# EAGLE design untitled (EAGLE 9.6.2)
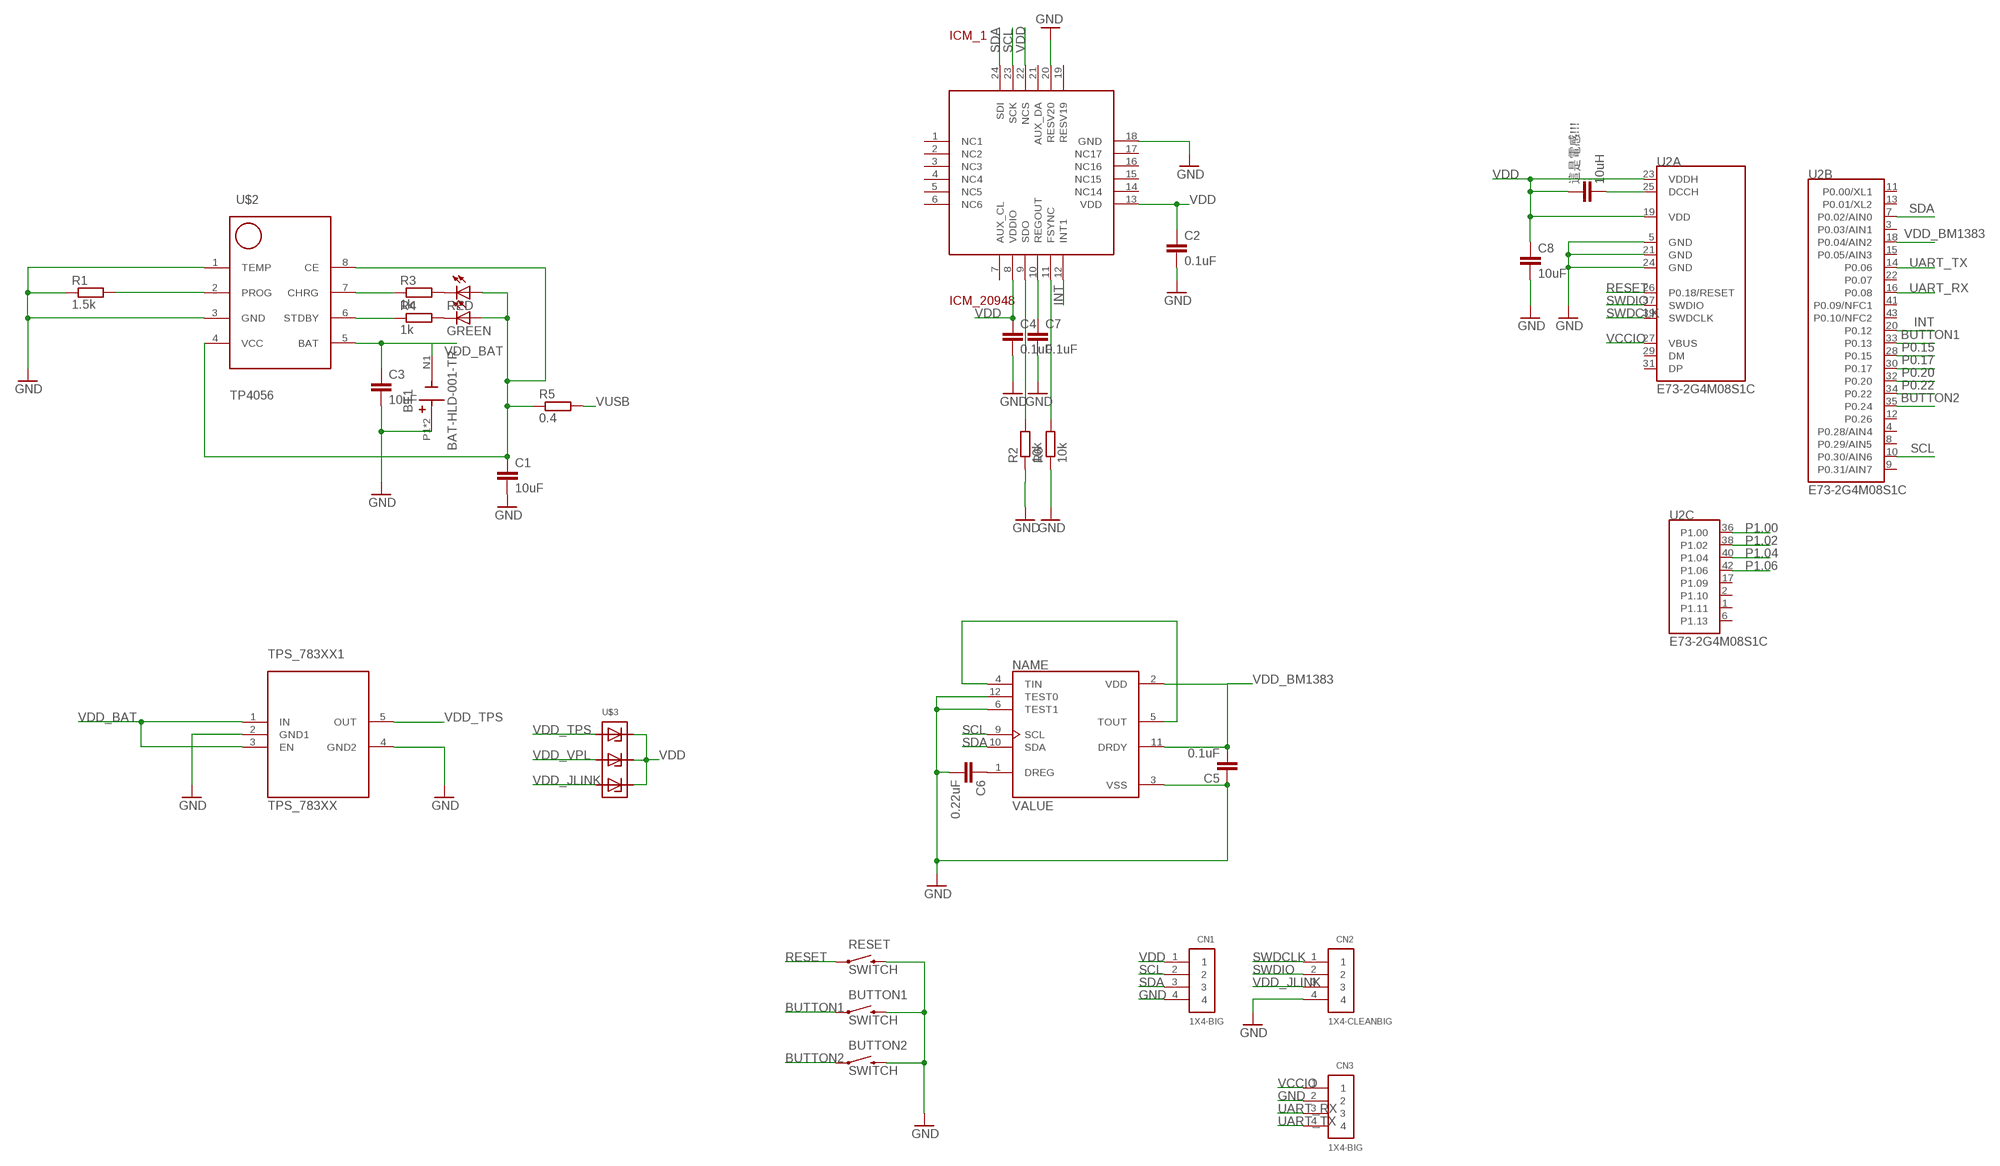
[diagram p0: schematic, sheet 1]

## Parts
BT1  BAT-HLD-001-TR  [BAT_BAT-HLD-001-TR]
BUTTON1  SWITCH  [SWITCH_2PIN]
BUTTON2  SWITCH  [SWITCH_2PIN]
C1  10uF  C-EUC0805  [C0805]
C2  0.1uF  C-EUC0805  [C0805]
C3  10uF  C-EUC0805  [C0805]
C4  0.1uF  C-EUC0805  [C0805]
C5  0.1uF  C-EUC0805  [C0805]
C6  0.22uF  C-EUC0805  [C0805]
C7  0.1uF  C-EUC0805  [C0805]
C8  10uF  C-EUC0805  [C0805]
CN1  1X4-BIG  [1X04-BIG]
CN2  1X4-CLEANBIG  [1X04-CLEANBIG]
CN3  1X4-BIG  [1X04-BIG]
GREEN  LED_E  [LED_1206]
ICM_1  ICM_20948  [QFN40P300X300X105-25N]
R1  1.5k  R  [R0805]
R2  10k  R  [R0805]
R3  1k  R  [R0805]
R4  1k  R  [R0805]
R5  0.4  R  [R0805]
R6  10k  R  [R0805]
RED  LED_E  [LED_1206]
RESET  SWITCH  [SWITCH_2PIN]
TPS_783XX1  TPS_783XX  [SOT65P280X145-5N]
U1  BM1383AGLV-ZE2  [PQFN55P250X250X100-12N]
U2  E73-2G4M08S1C  [E73-2G4M08S1C]
U$2  TP4056  [SOP8]
U$3  SD103ATW  [SOT363]
這是電感!!!  10uH  C-EUC0805  [C0805]

## Nets
BUTTON1: BUTTON1.1 U2.33(B:P0.13)
BUTTON2: BUTTON2.1 U2.35(B:P0.24)
GND: BT1.P1(+) BT1.P2(+) BUTTON1.2 BUTTON2.2 C1.2 C2.2 C3.2 C4.2 C5.1 C6.2 C7.2 C8.2 CN1.4 CN2.4 CN3.2 ICM_1.18(GND) ICM_1.20(RESV20) R1.1 R2.1 R6.1 RESET.2 TPS_783XX1.2(GND1) TPS_783XX1.4(GND2) U1.3(VSS) U1.6(TEST1) U1.12(TEST0) U2.5(A:GND) U2.21(A:GND) U2.24(A:GND) U$2.1(TEMP) U$2.3(GND)
INT: ICM_1.12(INT1) U2.20(B:P0.12)
N$1: R1.2 U$2.2(PROG)
N$2: GREEN.C R4.2
N$3: R3.1 U$2.7(CHRG)
N$4: R3.2 RED.C
N$5: R4.1 U$2.6(STDBY)
N$6: C1.1 GREEN.A R5.1 RED.A U$2.4(VCC) U$2.8(CE)
N$8: U1.4(TIN) U1.5(TOUT)
N$9: C6.1 U1.1(DREG)
N$10: U2.25(A:DCCH) 這是電感!!!.2
N$11: ICM_1.9(SDO) R2.2
N$13: C7.1 ICM_1.10(REGOUT)
N$15: ICM_1.11(FSYNC) R6.2
P0.15: U2.28(B:P0.15)
P0.17: U2.30(B:P0.17)
P0.20: U2.32(B:P0.20)
P0.22: U2.34(B:P0.22)
P1.00: U2.36(C:P1.00)
P1.02: U2.38(C:P1.02)
P1.04: U2.40(C:P1.04)
P1.06: U2.42(C:P1.06)
RESET: RESET.1 U2.26(A:P0.18/RESET)
SCL: CN1.2 ICM_1.23(SCK) U1.9(SCL) U2.10(B:P0.30/AIN6)
SDA: CN1.3 ICM_1.24(SDI) U1.10(SDA) U2.7(B:P0.02/AIN0)
SWDCLK: CN2.1 U2.39(A:SWDCLK)
SWDIO: CN2.2 U2.37(A:SWDIO)
UART_RX: CN3.3 U2.16(B:P0.08)
UART_TX: CN3.4 U2.14(B:P0.06)
VCCIO: CN3.1 U2.27(A:VBUS)
VDD: C2.1 C4.1 C8.1 CN1.1 ICM_1.8(VDDIO) ICM_1.13(VDD) ICM_1.22(NCS) U2.19(A:VDD) U2.23(A:VDDH) U$3.2 U$3.4 U$3.6 這是電感!!!.1
VDD_BAT: BT1.N1(-) C3.1 TPS_783XX1.1(IN) TPS_783XX1.3(EN) U$2.5(BAT)
VDD_BM1383: C5.2 U1.2(VDD) U1.11(DRDY) U2.18(B:P0.04/AIN2)
VDD_JLINK: CN2.3 U$3.5
VDD_TPS: TPS_783XX1.5(OUT) U$3.1
VDD_VPL: U$3.3
VUSB: R5.2
Unconnected: ICM_1.1(NC1) ICM_1.2(NC2) ICM_1.3(NC3) ICM_1.4(NC4) ICM_1.5(NC5) ICM_1.6(NC6) ICM_1.7(AUX_CL) ICM_1.14(NC14) ICM_1.15(NC15) ICM_1.16(NC16) ICM_1.17(NC17) ICM_1.19(RESV19) ICM_1.21(AUX_DA) U2.1(C:P1.11) U2.2(C:P1.10) U2.3(B:P0.03/AIN1) U2.4(B:P0.28/AIN4) U2.6(C:P1.13) U2.8(B:P0.29/AIN5) U2.9(B:P0.31/AIN7) U2.11(B:P0.00/XL1) U2.12(B:P0.26) U2.13(B:P0.01/XL2) U2.15(B:P0.05/AIN3) U2.17(C:P1.09) U2.22(B:P0.07) U2.29(A:DM) U2.31(A:DP) U2.41(B:P0.09/NFC1) U2.43(B:P0.10/NFC2)

## Library data of the parts
BT1 = BAT-HLD-001-TR:BAT-HLD-001-TR: Battery Retainer Coin, 20.0mm 1 Cell SMD (SMT) Tab Check availability <https://pricing.snapeda.com/parts/BAT-HLD-001-TR/Linx/view-part?ref=eda>; AVAILABILITY: In Stock; DESCRIPTION: Battery Retainer Coin, 20.0mm 1 Cell SMD (SMT) Tab; MF: Linx; MP: BAT-HLD-001-TR; PACKAGE: None; PRICE: None; PURCHASE-URL: https://pricing.snapeda.com/search/part/BAT-HLD-001-TR/?ref=eda
BUTTON1 BUTTON2 RESET = all_in_one:SWITCH
C1-C8 這是電感!!! = rcl-2:C-EU: CAPACITOR, European symbol
CN1-CN3 = adafruit:1X4: 4-pin connector
GREEN RED = eagle-ltspice:LED_E: LED Source: http://www.osram.convergy.de Source: www.luxeon.com Source: www.kingbright.com; SPICEMODEL: NONE; SPICEPREFIX: D; SPICETYPE: diode
ICM_1 = all_in_one:ICM_20948
R1-R6 = eagle-ltspice:R: RESISTOR, European symbol; SPICEMODEL: NONE; SPICEPREFIX: R
TPS_783XX1 = all_in_one:TPS_783XX
U1 = BM1383AGLV-ZE2:BM1383AGLV-ZE2: Pressure Sensor 30kPa to 110kPa 12-Pin CLGA T/R Check availability <https://pricing.snapeda.com/parts/BM1383AGLV-ZE2/Rohm/view-part?ref=eda>; AVAILABILITY: In Stock; DESCRIPTION: Pressure Sensor 4.35PSI ~ 15.95PSI (30kPa ~ 110kPa) Absolute - 16 b 12-VFLGA; MF: Rohm; MP: BM1383AGLV-ZE2; PACKAGE: VFLGA-12 Rohm; PRICE: None; PURCHASE-URL: https://pricing.snapeda.com/search/part/BM1383AGLV-ZE2/?ref=eda
U2 = E73-2G4M08S1C:E73-2G4M08S1C
U$2 = all_in_one:TP4056
U$3 = all_in_one:SD103ATW

## Board
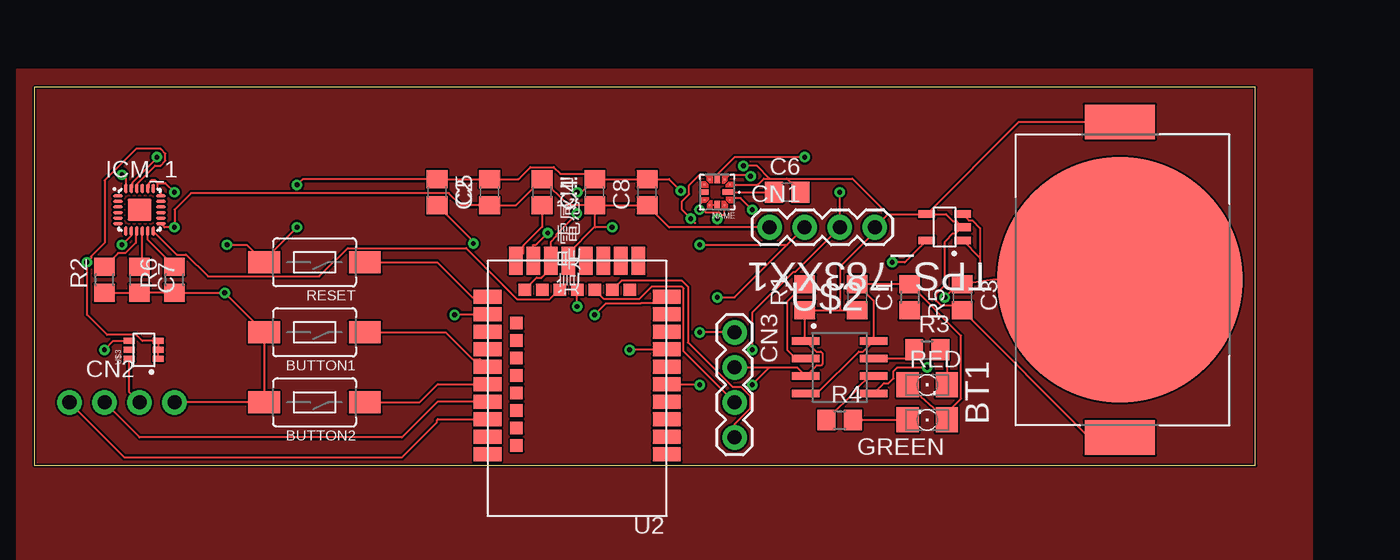
[diagram p1: board, top side]
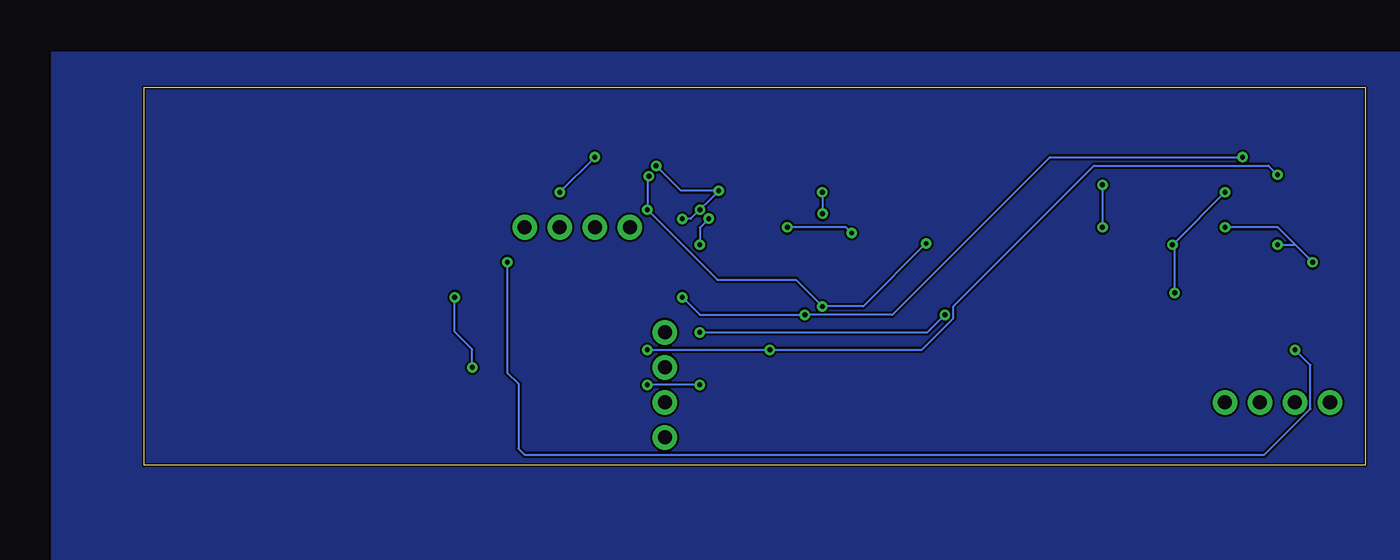
[diagram p2: board, bottom side, seen from below]

Size 88.57 x 27.42 mm. Coordinates in mm from the lower left corner, seen from the top.
Outline: 0,0 88.57,0 88.57,27.42 0,27.42 0,0
Copper layers (1*16): Top 0.035mm / dielectric 1.5mm / Bottom 0.035mm
Design rules "default1": minimum track width 6mil, minimum drill 0.3mm, track to track 6mil, track to pad 6mil, pad to pad 6mil, via to via 6mil, smd to smd 6mil, copper to edge 6mil, drill to drill 6mil, minimum pad ring 10mil, minimum via ring 8mil, stop-mask expansion 4mil, vias tented up to drill 0mil, thermal gap 6mil

### Footprints (pad centres in the part's own frame; a part is rotated, then mirrored left to right if it is on the bottom)
BAT_BAT-HLD-001-TR = smd 17.8 x 17.8: N1 0,0 | smd 2.5 x 5.1: P1 -11.45,0; P2 11.45,0
SWITCH_2PIN = smd 2.3 x 1.6: 1 -3.65,0; 2 3.65,0
C0805 = smd 1.3 x 1.5: 1 -0.95,0; 2 0.95,0
1X04-BIG = drill 1.016 pad 1.778: 1 0,0; 2 2.54,0; 3 5.08,0; 4 7.62,0
1X04-CLEANBIG = drill 1.016 pad 1.778: 1 -3.81,0; 2 -1.27,0; 3 1.27,0; 4 3.81,0
LED_1206 = smd 1.6 x 1.803: A -1.422,0; C 1.422,0
QFN40P300X300X105-25N = smd 0.7 x 0.2: 1 -1.55,1; 2 -1.55,0.6; 3 -1.55,0.2; 4 -1.55,-0.2; 5 -1.55,-0.6; 6 -1.55,-1; 13 1.55,-1; 14 1.55,-0.6; 15 1.55,-0.2; 16 1.55,0.2; 17 1.55,0.6; 18 1.55,1 | smd 0.2 x 0.7: 7 -1,-1.55; 8 -0.6,-1.55; 9 -0.2,-1.55; 10 0.2,-1.55; 11 0.6,-1.55; 12 1,-1.55; 19 1,1.55; 20 0.6,1.55; 21 0.2,1.55; 22 -0.2,1.55; 23 -0.6,1.55; 24 -1,1.55 | smd 1.75 x 1.6: 25 0,0
R0805 = smd 1.3 x 1.5: 1 -0.95,0; 2 0.95,0
SOT65P280X145-5N = smd 1.2 x 0.55: 1 -1.3,0.95; 2 -1.3,0; 3 -1.3,-0.95; 4 1.3,-0.95; 5 1.3,0.95
PQFN55P250X250X100-12N = smd 0.83 x 0.4: 1 -0.8,0 | smd 0.1 x 0.1: 2 -0.925,0.55; 3 -0.55,0.925; 5 0.55,0.925; 6 0.925,0.55; 8 0.925,-0.55; 9 0.55,-0.925; 11 -0.55,-0.925; 12 -0.925,-0.55 | smd 0.4 x 0.58: 4 0,0.925; 10 0,-0.925 | smd 0.58 x 0.4: 7 0.925,0
E73-2G4M08S1C = smd 2 x 1: 1 -6.5,5.03; 2 -6.5,3.76; 3 -6.5,2.49; 4 -6.5,1.22; 5 -6.5,-0.05; 6 -6.5,-1.32; 7 -6.5,-2.59; 8 -6.5,-3.86; 9 -6.5,-5.13; 10 -6.5,-6.4; 26 6.5,-6.4; 27 6.5,-5.13; 29 6.5,-3.86; 31 6.5,-2.59; 33 6.5,-1.32; 35 6.5,-0.05; 37 6.5,1.22; 39 6.5,2.49; 41 6.5,3.76; 43 6.5,5.03 | smd 1 x 2: 11 -4.44,-9; 13 -3.17,-9; 15 -1.9,-9; 17 -0.63,-9; 19 0.64,-9; 21 1.91,-9; 23 3.18,-9; 25 4.45,-9 | smd 0.9 x 0.9: 12 -3.81,-6.9; 14 -2.54,-6.9; 16 -1.27,-6.9; 18 0,-6.9; 20 1.27,-6.9; 22 2.54,-6.9; 24 3.81,-6.9; 28 4.4,-4.495; 30 4.4,-3.225; 32 4.4,-1.955; 34 4.4,-0.685; 36 4.4,0.585; 38 4.4,1.855; 40 4.4,3.125; 42 4.4,4.395
SOP8 = smd 1.981 x 0.559: 1 -2.464,1.905; 2 -2.464,0.635; 3 -2.464,-0.635; 4 -2.464,-1.905; 5 2.464,-1.905; 6 2.464,-0.635; 7 2.464,0.635; 8 2.464,1.905
SOT363 = smd 0.42 x 0.8: 1 0.65,2; 2 0.65,-0.1; 3 0,2; 4 0,-0.1; 5 -0.65,2; 6 -0.65,-0.1

### Placement (x,y rotation side)
BT1  78.74,13.46 90 top
BUTTON1  20.32,9.65 180 top
BUTTON2  20.32,4.57 180 top
C1  59.69,12.19 270 top
C2  33.02,19.81 90 top
C3  67.31,12.19 270 top
C4  40.64,19.81 90 top
C5  29.21,19.81 270 top
C6  54.61,19.81 0 top
C7  7.62,13.46 270 top
C8  44.45,19.81 90 top
CN1  53.34,17.27 0 top
CN2  6.35,4.57 0 top
CN3  50.8,9.65 270 top
GREEN  64.77,3.3 180 top
ICM_1  7.62,18.54 0 top
R1  55.88,12.19 90 top
R2  5.08,13.46 90 top
R3  64.77,8.38 0 top
R4  58.42,3.3 0 top
R5  63.5,12.19 270 top
R6  10.16,13.46 90 top
RED  64.77,5.84 0 top
RESET  20.32,14.73 180 top
TPS_783XX1  66.04,17.27 180 top
U1  49.53,19.81 180 top
U2  39.37,5.84 180 top
U$2  58.42,7.11 0 top
U$3  8.89,8.38 90 top
這是電感!!!  36.83,19.81 270 top

### Tracks (layer width: path | path; a pad name or v marks a point on that pad's centre or on a via)
BUTTON1
  Top 0.152: U2.33 32.33,7.7 31.77,7.7 29.83,9.65 BUTTON1.1
BUTTON2
  Top 0.152: BUTTON2.1 27.94,4.57 29.26,5.89 U2.35
GND  (via drill 0.35)
  Top 0.152: R2.1 C7.2 R6.1 v13.81,12.51 BUTTON1.2 16.67,4.73 16.51,4.57 | v13.97,16 15.4,16 16.59,14.81 | 16.59,14.81 RESET.2 | 8.95,20.48 8.95,20.07 9.17,19.85 ICM_1.18 | 8.95,20.48 8.76,20.67 8.48,20.67 8.29,20.48 8.29,20.16 ICM_1.20 | C4.2 C8.2 46.04,20.76 v46.88,19.92 | U1.3 50.07,18.9 50.07,18.18 49.84,18.18 | U1.12 52.49,20.36 52.91,20.79 53.34,20.79 | 53.34,20.79 54.58,20.79 | 54.58,20.79 C6.2 | 58.42,11.24 R1.1 55.88,9.09 U$2.1 56.72,8.25 57.04,8.25 57.18,8.12 57.18,7.37 57.04,7.24 56.72,7.24 U$2.3 55.32,7.11 53.34,7.11 | 58.42,11.24 C1.2 | 67.32,17.29 66.89,17.72 66.65,17.72 66.14,18.22 TPS_783XX1.4 | 67.32,17.29 TPS_783XX1.2 | TPS_783XX1.4 71.43,24.91 BT1.P2 | 61.91,18.22 CN1.4 60.96,16.95 58.42,14.41 58.42,11.24 | 61.91,18.22 TPS_783XX1.4 | U2.24 36.43,13.61 36.79,13.61 37.46,14.29 U2.21 37.46,16.22 37.85,16.61 37.85,16.75 v39.36,18.26 | 53.34,20.79 52.41,21.73 v51.43,21.73 | U1.6 47.88,18.54 v48.25,18.54 48.51,18.54 48.69,18.37 49.65,18.37 49.84,18.18 | v49.53,17.88 49.84,18.18 | 8.95,20.48 9.49,20.48 v10.16,19.81 | 67.32,17.29 66.86,16.83 66.65,16.83 66.04,16.22 66.04,13.05 65.43,12.44 65.43,11.94 65.79,11.59 66.97,11.59 C3.2 76.54,2.01 BT1.P1 | CN3.2 53.34,7.11 | U2.5 48.21,5.89 v48.26,5.84 | v52.07,5.84 53.34,7.11 | BUTTON2.2 16.51,4.57 | 16.51,4.57 CN2.4 | C4.2 39.69,19.81 v39.37,19.81 | v19.05,20.35 19.46,20.76 C5.1 C2.2 35.11,20.76 35.98,21.64 37.67,21.64 38.17,21.15 40.25,21.15 C4.2 | v19.05,17.27 16.59,14.81 | 54.58,20.79 59.34,20.79 61.91,18.22
  Bottom 0.152: v51.43,21.73 49.62,19.92 v46.88,19.92 48.92,17.88 v49.53,17.88 | v13.81,12.51 13.81,15.84 | 13.81,15.84 v13.97,16 | v10.16,19.81 13.81,16.16 13.81,15.84 | v48.26,5.84 v52.07,5.84 | v39.37,19.81 39.37,18.27 v39.36,18.26 | v19.05,20.35 v19.05,17.27
GND1
  pour Top: -1.27,28.7 -1.27,-5.59 -1.27,-9.4 92.71,-9.4 92.71,28.7
  pour Bottom: -5.08,29.97 -5.08,-14.48 95.25,-14.48 95.25,29.97
INT
  Top 0.152: ICM_1.12 10.32,15.29 11,15.29 12.59,13.7 20.67,13.7 22.73,15.76 31.32,15.76 35.02,12.06 37.38,12.06 38.05,12.74 U2.20
N$1
  Top 0.152: R1.2 54.61,11.87 54.61,8.38 55.24,7.75 U$2.2
N$2
  Top 0.152: R4.2 GREEN.C
N$3
  Top 0.152: R3.1 63.18,7.75 U$2.7
N$4
  Top 0.152: R3.2 66.19,7.91 RED.C
N$5
  Top 0.152: R4.1 59.66,5.5 59.66,5.58 60.56,6.48 U$2.6
N$6
  Top 0.152: RED.A GREEN.A 66.19,3.82 67.22,4.85 67.22,9.42 R5.1 C1.1 60.88,11.95 U$2.8 60.12,8.25 59.8,8.25 56.75,5.21 U$2.4
N$8
  Top 0.152: U1.5 U1.4
N$9
  Top 0.152: U1.1 C6.1
N$10
  Top 0.152: U2.25 35.46,15.38 35.46,15.94 36.83,17.3 這是電感!!!.2
N$11
  Top 0.152: ICM_1.9 7.35,16.92 7.35,16.14 6.6,15.39 6.06,15.39 R2.2
N$13
  Top 0.152: C7.1 7.82,14.61 ICM_1.10
N$15
  Top 0.152: R6.2 8.22,16.35 ICM_1.11
RESET
  Top 0.152: RESET.1 29.21,14.73 31.75,12.19 32.82,12.19 U2.26
SCL  (via drill 0.35)
  Top 0.152: 54.61,16 50.8,12.19 v49.53,12.19 | 54.61,16 CN1.2 | ICM_1.23 7.09,20.16 7.09,20.51 8.89,22.31 v8.89,22.35 | U1.9 48.63,21.08 48.26,21.08 47.49,20.31 47.49,19.67 46.99,19.17 46.99,18.54 47.95,17.58 47.93,17.58 v47.61,17.89 | U2.10 45.32,12.24 44.86,11.78 44.02,11.78 43.99,11.76 41.48,11.76 v40.64,10.92 | v48.26,16 54.61,16
  Bottom 0.152: v8.89,22.35 22.86,22.35 34.29,10.92 v40.64,10.92 48.26,10.92 v49.53,12.19 | v47.61,17.89 48.26,17.25 v48.26,16
SDA  (via drill 0.35)
  Top 0.152: v52.07,8.38 52.07,11.05 55.04,14.02 55.17,14.02 CN1.3 v58.42,19.81 | v6.35,21.08 6.62,20.81 ICM_1.24 | U1.10 49.53,21.08 50.8,22.35 54.61,22.35 54.74,22.35 v55.88,22.35 | v43.18,8.38 43.23,8.43 U2.7
  Bottom 0.152: v6.35,21.08 7.01,21.75 19.66,21.75 29.87,11.53 29.87,10.67 32.16,8.38 v43.18,8.38 v52.07,8.38 | v58.42,19.81 v55.88,22.35
SWDCLK
  Top 0.152: CN2.1 6.53,0.58 26.67,0.58 29.21,3.12 29.21,3.3 29.26,3.35 U2.39
SWDIO
  Top 0.152: U2.37 29.26,4.62 26.67,2.03 7.62,2.03 CN2.2
UART_RX
  Top 0.152: CN3.3 47.1,8.27 47.1,12.84 46.97,12.97 44.77,12.97 43.87,12.06 43.73,12.06 43.18,12.06 41.32,12.06 U2.16
UART_TX
  Top 0.152: CN3.4 50.8,2.99 51.92,4.11 51.92,5.04 51.26,5.69 50.64,5.69 47.4,8.93 47.4,12.96 46.95,13.42 42.63,13.42 41.96,12.74 U2.14
VCCIO  (via drill 0.35)
  Top 0.152: v30.48,10.92 30.53,10.97 U2.27 | CN3.1 v48.26,9.65
  Bottom 0.152: v48.26,9.65 31.75,9.65 v30.48,10.92
VDD  (via drill 0.35)
  Top 0.152: C4.1 38.73,18.86 這是電感!!!.1 34.93,18.86 C2.1 30.93,18.86 30.05,19.74 11.36,19.74 10.16,18.54 v10.16,17.27 9.44,17.27 ICM_1.13 | C4.1 C8.1 46.04,17.27 CN1.1 | C4.1 40.64,17.3 | 40.64,17.3 38.73,15.39 U2.19 | U2.23 36.19,16 36.38,16 v37.24,16.86 | U$3.6 U$3.4 U$3.2 7.82,9.03 7.39,9.47 5.26,9.47 3.81,10.92 v3.81,14.73 | v3.81,14.73 v3.8,14.73 | ICM_1.8 7.02,16.67 v6.35,16 | ICM_1.22 7.42,20.41 8.76,21.75 9.14,21.75 9.5,22.1 9.5,22.6 9.14,22.96 7.37,22.96 5.08,20.67 5.08,16.14 4.1,15.16 4.1,15.02 v3.81,14.73 | v41.91,17.27 40.67,17.27 40.64,17.3
  Bottom 0.152: v3.8,14.73 5.07,16.01 | 5.07,16.01 6.34,17.27 v10.16,17.27 | v6.35,16 5.08,16 5.07,16.01 | v37.24,16.86 37.66,17.27 v41.91,17.27
VDD_BAT  (via drill 0.35)
  Top 0.152: U$2.5 61.24,5.56 61.52,5.84 61.65,5.97 61.97,5.97 62.32,6.32 62.32,6.84 62.59,7.11 v64.77,7.11 | BT1.N1 69.53,13.46 68.6,13.33 | 68.6,13.33 67.35,13.15 | 67.35,13.15 C3.1 | v66.04,12.19 67,13.15 67.35,13.15 | TPS_783XX1.3 67.79,17.78 68.03,17.78 68.6,17.21 68.6,15.06 | 68.6,15.06 68.6,13.33 | TPS_783XX1.1 68.6,15.06
  Bottom 0.152: v66.04,12.19 66.04,9.69 64.77,8.42 v64.77,7.11
VDD_BM1383  (via drill 0.35)
  Top 0.152: v52.07,18.54 51.23,19.38 50.58,19.38 U1.2 | v39.37,11.53 U2.18 | C5.2 31.75,16.32 31.75,16 v31.84,16.09 | U1.11 50.42,21.08 51.84,21.08 v51.96,20.97
  Bottom 0.152: v31.84,16.09 36.41,11.53 v39.37,11.53 41.3,13.46 46.99,13.46 v52.07,18.54 52.07,20.86 v51.96,20.97
VDD_JLINK
  Top 0.152: CN2.3 6.89,5.3 U$3.5
VDD_TPS  (via drill 0.35)
  Top 0.152: TPS_783XX1.5 63.15,14.73 v62.23,14.73 | v5.08,8.38 5.73,9.03 U$3.1
  Bottom 0.152: v62.23,14.73 62.23,6.74 61.41,5.92 61.41,1.21 60.96,0.76 7.31,0.76 3.96,4.11 3.96,7.26 v5.08,8.38